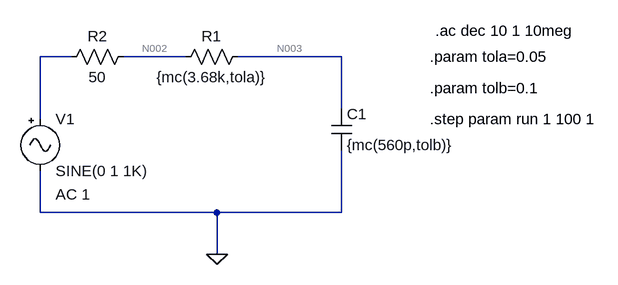
[diagram p0: schematic Spice.asc]
Spice.asc, the LTspice schematic file:
Version 4
SHEET 1 880 680
WIRE -144 0 -192 0
WIRE 32 0 -64 0
WIRE 272 0 112 0
WIRE 272 80 272 0
WIRE -192 96 -192 0
WIRE -192 240 -192 176
WIRE 80 240 -192 240
WIRE 272 240 272 144
WIRE 272 240 80 240
WIRE 80 304 80 240
FLAG 80 304 0
SYMBOL res 128 -16 R90
WINDOW 0 0 56 VBottom 2
WINDOW 3 32 56 VTop 2
SYMATTR InstName R1
SYMATTR Value {mc(3.68k,tola)}
SYMBOL cap 256 80 R0
SYMATTR InstName C1
SYMATTR Value {mc(560p,tolb)}
SYMBOL res -48 -16 R90
WINDOW 0 0 56 VBottom 2
WINDOW 3 32 56 VTop 2
SYMATTR InstName R2
SYMATTR Value 50
SYMBOL Misc\\signal -192 80 R0
WINDOW 123 24 132 Left 2
WINDOW 39 0 0 Left 2
SYMATTR Value2 AC 1
SYMATTR InstName V1
TEXT 416 -40 Left 2 !.ac dec 10 1 10meg
TEXT 408 0 Left 2 !.param tola=0.05
TEXT 408 48 Left 2 !.param tolb=0.1
TEXT 408 96 Left 2 !.step param run 1 100 1

The netlist it stands for:
* Spice.asc
R1 N003 N002 {mc(3.68k,tola)}
C1 N003 0 {mc(560p,tolb)}
R2 N002 N001 50
V1 N001 0 SINE(0 1 1K) AC 1
.ac dec 10 1 10meg
.param tola=0.05
.param tolb=0.1
.step param run 1 100 1
.backanno
.end

* Results of the author's LTspice run, read from the files saved beside the schematic
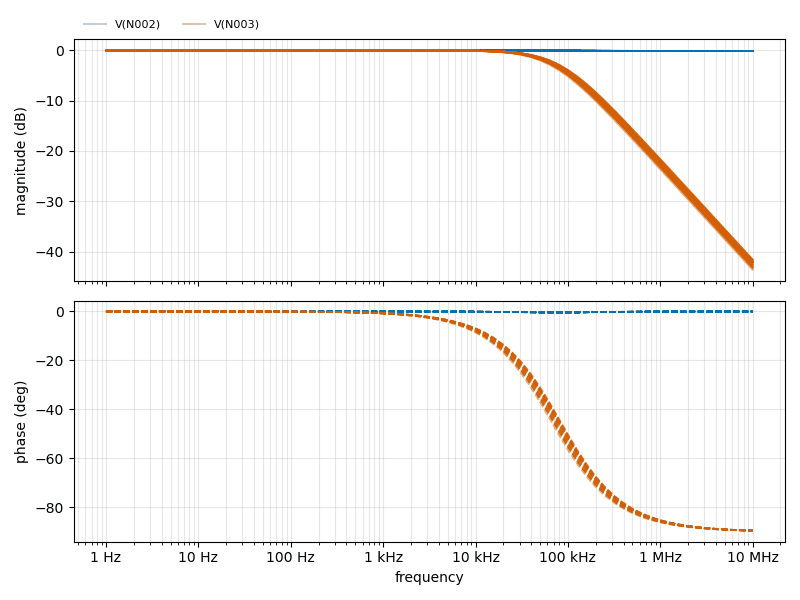
[diagram p1: AC Analysis of Spice.asc, plotted from the saved traces]
* AC Analysis, 100 runs:
*   V(N002) [run 1]: -0.00 dB at 1 Hz, -0.12 dB at 10 MHz, peak -0.00 dB at 1 Hz
*   V(N002) [run 2]: -0.00 dB at 1 Hz, -0.11 dB at 10 MHz, peak -0.00 dB at 1 Hz
*   V(N002) [run 3]: -0.00 dB at 1 Hz, -0.12 dB at 10 MHz, peak -0.00 dB at 1 Hz
*   V(N002) [run 4]: -0.00 dB at 1 Hz, -0.12 dB at 10 MHz, peak -0.00 dB at 1 Hz
*   V(N002) [run 5]: -0.00 dB at 1 Hz, -0.11 dB at 10 MHz, peak -0.00 dB at 1 Hz
*   V(N002) [run 6]: -0.00 dB at 1 Hz, -0.12 dB at 10 MHz, peak -0.00 dB at 1 Hz
*   V(N002) [run 7]: -0.00 dB at 1 Hz, -0.11 dB at 10 MHz, peak -0.00 dB at 1 Hz
*   V(N002) [run 8]: -0.00 dB at 1 Hz, -0.11 dB at 10 MHz, peak -0.00 dB at 1 Hz
*   V(N003) [run 1]: -0.00 dB at 1 Hz, -42.03 dB at 10 MHz, peak -0.00 dB at 1 Hz, 3 dB below the peak at 79.09 kHz
*   V(N003) [run 2]: -0.00 dB at 1 Hz, -42.56 dB at 10 MHz, peak -0.00 dB at 1 Hz, 3 dB below the peak at 74.02 kHz
*   V(N003) [run 3]: -0.00 dB at 1 Hz, -42.51 dB at 10 MHz, peak -0.00 dB at 1 Hz, 3 dB below the peak at 74.49 kHz
*   V(N003) [run 4]: -0.00 dB at 1 Hz, -42.03 dB at 10 MHz, peak -0.00 dB at 1 Hz, 3 dB below the peak at 79.15 kHz
*   V(N003) [run 5]: -0.00 dB at 1 Hz, -43.60 dB at 10 MHz, peak -0.00 dB at 1 Hz, 3 dB below the peak at 65.78 kHz
*   V(N003) [run 6]: -0.00 dB at 1 Hz, -41.76 dB at 10 MHz, peak -0.00 dB at 1 Hz, 3 dB below the peak at 81.42 kHz
*   V(N003) [run 7]: -0.00 dB at 1 Hz, -41.86 dB at 10 MHz, peak -0.00 dB at 1 Hz, 3 dB below the peak at 80.6 kHz
*   V(N003) [run 8]: -0.00 dB at 1 Hz, -42.30 dB at 10 MHz, peak -0.00 dB at 1 Hz, 3 dB below the peak at 76.44 kHz